# Altium schematic sheet power.SchDoc
size A
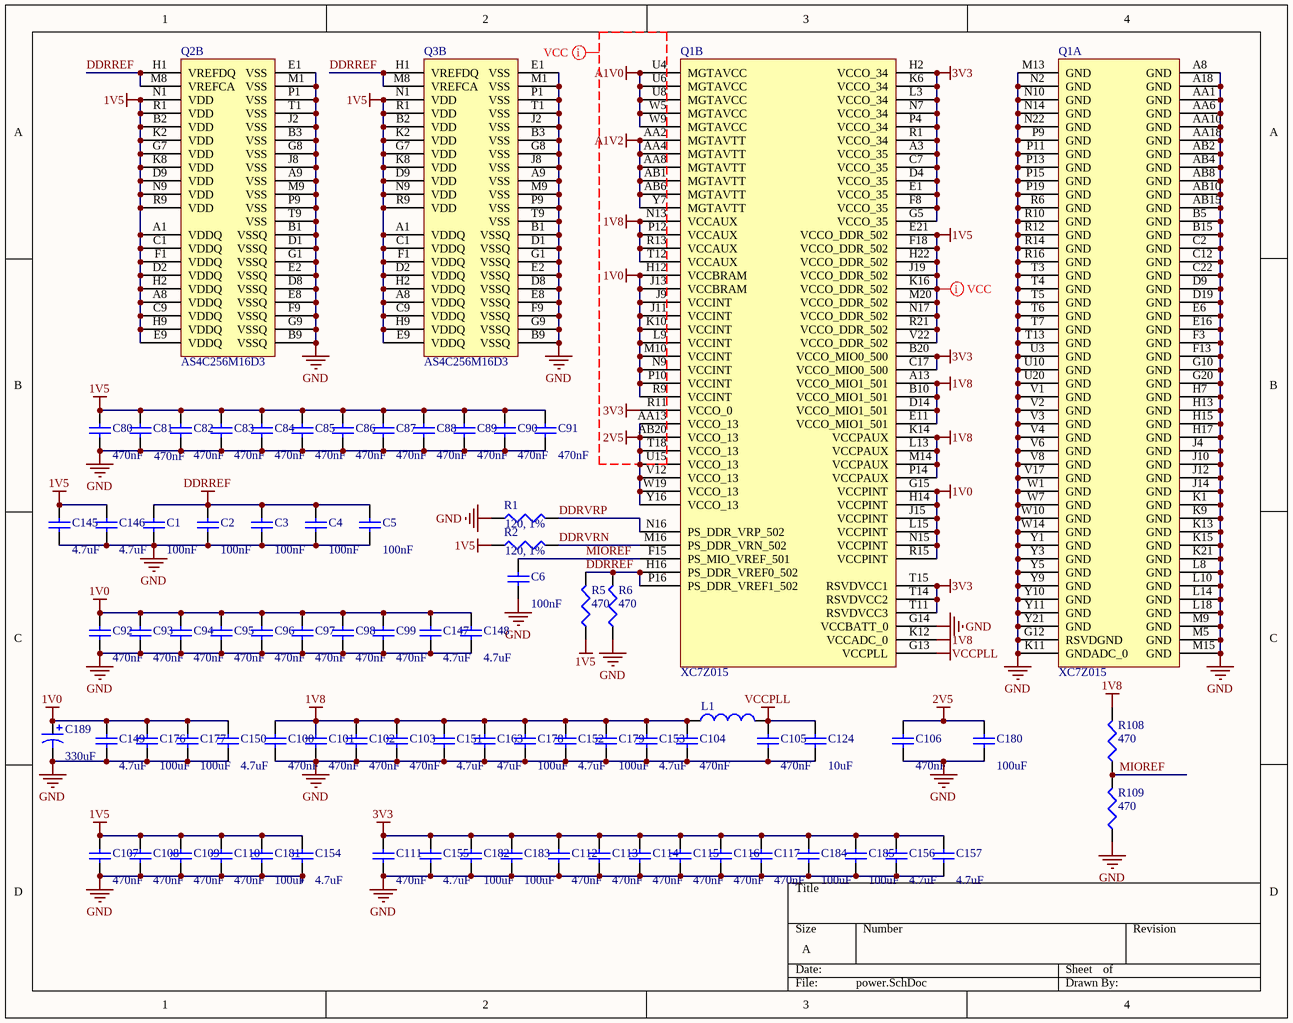
[diagram p0: power.SchDoc]

## Parts
C1  value 100nF  [CAPC1005X06L]  (hidden comment: Cap)
C2  value 100nF  [CAPC1005X06L]  (hidden comment: Cap)
C3  value 100nF  [CAPC1005X06L]  (hidden comment: Cap)
C4  value 100nF  [CAPC1005X06L]  (hidden comment: Cap)
C5  value 100nF  [CAPC1005X06L]  (hidden comment: Cap)
C6  value 100nF  [CAPC1005X06L]  (hidden comment: Cap)
C80  value 470nF  [CAPC1005X06L]  (hidden comment: JMK105BJ474KV-F)
C81  value 470nF  [CAPC1005X06L]  (hidden comment: JMK105BJ474KV-F)
C82  value 470nF  [CAPC1005X06L]  (hidden comment: JMK105BJ474KV-F)
C83  value 470nF  [CAPC1005X06L]  (hidden comment: JMK105BJ474KV-F)
C84  value 470nF  [CAPC1005X06L]  (hidden comment: JMK105BJ474KV-F)
C85  value 470nF  [CAPC1005X06L]  (hidden comment: JMK105BJ474KV-F)
C86  value 470nF  [CAPC1005X06L]  (hidden comment: JMK105BJ474KV-F)
C87  value 470nF  [CAPC1005X06L]  (hidden comment: JMK105BJ474KV-F)
C88  value 470nF  [CAPC1005X06L]  (hidden comment: JMK105BJ474KV-F)
C89  value 470nF  [CAPC1005X06L]  (hidden comment: JMK105BJ474KV-F)
C90  value 470nF  [CAPC1005X06L]  (hidden comment: JMK105BJ474KV-F)
C91  value 470nF  [CAPC1005X06L]  (hidden comment: JMK105BJ474KV-F)
C92  value 470nF  [CAPC1005X06L]  (hidden comment: JMK105BJ474KV-F)
C93  value 470nF  [CAPC1005X06L]  (hidden comment: JMK105BJ474KV-F)
C94  value 470nF  [CAPC1005X06L]  (hidden comment: JMK105BJ474KV-F)
C95  value 470nF  [CAPC1005X06L]  (hidden comment: JMK105BJ474KV-F)
C96  value 470nF  [CAPC1005X06L]  (hidden comment: JMK105BJ474KV-F)
C97  value 470nF  [CAPC1005X06L]  (hidden comment: JMK105BJ474KV-F)
C98  value 470nF  [CAPC1005X06L]  (hidden comment: JMK105BJ474KV-F)
C99  value 470nF  [CAPC1005X06L]  (hidden comment: JMK105BJ474KV-F)
C100  value 470nF  [CAPC1005X06L]  (hidden comment: JMK105BJ474KV-F)
C101  value 470nF  [CAPC1005X06L]  (hidden comment: JMK105BJ474KV-F)
C102  value 470nF  [CAPC1005X06L]  (hidden comment: JMK105BJ474KV-F)
C103  value 470nF  [CAPC1005X06L]  (hidden comment: JMK105BJ474KV-F)
C104  value 470nF  [CAPC1005X06L]  (hidden comment: JMK105BJ474KV-F)
C105  value 470nF  [CAPC1005X06L]  (hidden comment: JMK105BJ474KV-F)
C106  value 470nF  [CAPC1005X06L]  (hidden comment: JMK105BJ474KV-F)
C107  value 470nF  [CAPC1005X06L]  (hidden comment: JMK105BJ474KV-F)
C108  value 470nF  [CAPC1005X06L]  (hidden comment: JMK105BJ474KV-F)
C109  value 470nF  [CAPC1005X06L]  (hidden comment: JMK105BJ474KV-F)
C110  value 470nF  [CAPC1005X06L]  (hidden comment: JMK105BJ474KV-F)
C111  value 470nF  [CAPC1005X06L]  (hidden comment: JMK105BJ474KV-F)
C112  value 470nF  [CAPC1005X06L]  (hidden comment: JMK105BJ474KV-F)
C113  value 470nF  [CAPC1005X06L]  (hidden comment: JMK105BJ474KV-F)
C114  value 470nF  [CAPC1005X06L]  (hidden comment: JMK105BJ474KV-F)
C115  value 470nF  [CAPC1005X06L]  (hidden comment: JMK105BJ474KV-F)
C116  value 470nF  [CAPC1005X06L]  (hidden comment: JMK105BJ474KV-F)
C117  value 470nF  [CAPC1005X06L]  (hidden comment: JMK105BJ474KV-F)
C124  value 10uF  [CAPC1608X90N]  (hidden comment: GRM188R60G106ME47)
C145  value 4.7uF  [CAPC1608X90N]  (hidden comment: GRM188R60J475ME19D)
C146  value 4.7uF  [CAPC1608X90N]  (hidden comment: GRM188R60J475ME19D)
C147  value 4.7uF  [CAPC1608X90N]  (hidden comment: GRM188R60J475ME19D)
C148  value 4.7uF  [CAPC1608X90N]  (hidden comment: GRM188R60J475ME19D)
C149  value 4.7uF  [CAPC1608X90N]  (hidden comment: GRM188R60J475ME19D)
C150  value 4.7uF  [CAPC1608X90N]  (hidden comment: GRM188R60J475ME19D)
C151  value 4.7uF  [CAPC1608X90N]  (hidden comment: GRM188R60J475ME19D)
C152  value 4.7uF  [CAPC1608X90N]  (hidden comment: GRM188R60J475ME19D)
C153  value 4.7uF  [CAPC1608X90N]  (hidden comment: GRM188R60J475ME19D)
C154  value 4.7uF  [CAPC1608X90N]  (hidden comment: GRM188R60J475ME19D)
C155  value 4.7uF  [CAPC1608X90N]  (hidden comment: GRM188R60J475ME19D)
C156  value 4.7uF  [CAPC1608X90N]  (hidden comment: GRM188R60J475ME19D)
C157  value 4.7uF  [CAPC1608X90N]  (hidden comment: GRM188R60J475ME19D)
C163  value 47uF  [CAPC3225X220N]  (hidden comment: GRM31CR60J476ME19L)
C176  value 100uF  [CAPC3225X220N]  (hidden comment: GRM31CR60J107ME39L)
C177  value 100uF  [CAPC3225X220N]  (hidden comment: GRM31CR60J107ME39L)
C178  value 100uF  [CAPC3225X220N]  (hidden comment: GRM31CR60J107ME39L)
C179  value 100uF  [CAPC3225X220N]  (hidden comment: GRM31CR60J107ME39L)
C180  value 100uF  [CAPC3225X220N]  (hidden comment: GRM31CR60J107ME39L)
C181  value 100uF  [CAPC3225X220N]  (hidden comment: GRM31CR60J107ME39L)
C182  value 100uF  [CAPC3225X220N]  (hidden comment: GRM31CR60J107ME39L)
C183  value 100uF  [CAPC3225X220N]  (hidden comment: GRM31CR60J107ME39L)
C184  value 100uF  [CAPC3225X220N]  (hidden comment: GRM31CR60J107ME39L)
C185  value 100uF  [CAPC3225X220N]  (hidden comment: GRM31CR60J107ME39L)
C189  value 330uF  [CAP-D/7343-31]  (hidden comment: T520D337M006ATE018)
L1  BLM18SG121TN1  [CAPC1608X90N]  (value not drawn)
Q1  XC7Z015  [BGA484x22]  (parts A,B of 9)
Q2  AS4C256M16D3  [DDR3]  (part B of 2)
Q3  AS4C256M16D3  [DDR3]  (part B of 2)
R1  value 120, 1%  [CAPC1005X06L]  (hidden comment: RC1005F121CS)
R2  value 120, 1%  [CAPC1005X06L]  (hidden comment: RC1005F121CS)
R5  value 470  [J1-0603]  (hidden comment: RC1608F471CS)
R6  value 470  [J1-0603]  (hidden comment: RC1608F471CS)
R108  value 470  [CAPC1005X06L]  (hidden comment: RC1005F471CS)
R109  value 470  [CAPC1005X06L]  (hidden comment: RC1005F471CS)

## Nets
1V0: C92.2 C93.2 C94.2 C95.2 C96.2 C97.2 C98.2 C99.2 C147.2 C148.2 C149.2 C150.2 C176.2 C177.2 C189.1 Q1.G15(VCCPINT) Q1.H12(VCCBRAM) Q1.H14(VCCPINT) Q1.J9(VCCINT) Q1.J11(VCCINT) Q1.J13(VCCBRAM) Q1.J15(VCCPINT) Q1.K10(VCCINT) Q1.L9(VCCINT) Q1.L15(VCCPINT) Q1.M10(VCCINT) Q1.N9(VCCINT) Q1.N15(VCCPINT) Q1.P10(VCCINT) Q1.R9(VCCINT) Q1.R15(VCCPINT)
1V5: C80.2 C81.2 C82.2 C83.2 C84.2 C85.2 C86.2 C87.2 C88.2 C89.2 C90.2 C91.2 C107.2 C108.2 C109.2 C110.2 C145.2 C146.2 C154.2 C181.2 Q1.E21(VCCO_DDR_502) Q1.F18(VCCO_DDR_502) Q1.H22(VCCO_DDR_502) Q1.J19(VCCO_DDR_502) Q1.K16(VCCO_DDR_502) Q1.M20(VCCO_DDR_502) Q1.N17(VCCO_DDR_502) Q1.R21(VCCO_DDR_502) Q1.V22(VCCO_DDR_502) Q2.A1(VDDQ) Q2.A8(VDDQ) Q2.B2(VDD) Q2.C1(VDDQ) Q2.C9(VDDQ) Q2.D2(VDDQ) Q2.D9(VDD) Q2.E9(VDDQ) Q2.F1(VDDQ) Q2.G7(VDD) Q2.H2(VDDQ) Q2.H9(VDDQ) Q2.K2(VDD) Q2.K8(VDD) Q2.N1(VDD) Q2.N9(VDD) Q2.R1(VDD) Q2.R9(VDD) Q3.A1(VDDQ) Q3.A8(VDDQ) Q3.B2(VDD) Q3.C1(VDDQ) Q3.C9(VDDQ) Q3.D2(VDDQ) Q3.D9(VDD) Q3.E9(VDDQ) Q3.F1(VDDQ) Q3.G7(VDD) Q3.H2(VDDQ) Q3.H9(VDDQ) Q3.K2(VDD) Q3.K8(VDD) Q3.N1(VDD) Q3.N9(VDD) Q3.R1(VDD) Q3.R9(VDD) R2.1 R5.1
1V8: C100.2 C101.2 C102.2 C103.2 C104.2 C151.2 C152.2 C153.2 C163.2 C178.2 C179.2 L1.1 Q1.A13(VCCO_MIO1_501) Q1.B10(VCCO_MIO1_501) Q1.D14(VCCO_MIO1_501) Q1.E11(VCCO_MIO1_501) Q1.K12(VCCADC_0) Q1.K14(VCCPAUX) Q1.L13(VCCPAUX) Q1.M14(VCCPAUX) Q1.N13(VCCAUX) Q1.P12(VCCAUX) Q1.P14(VCCPAUX) Q1.R13(VCCAUX) Q1.T12(VCCAUX) R108.2
2V5: C106.2 C180.2 Q1.AA13(VCCO_13) Q1.AB20(VCCO_13) Q1.T18(VCCO_13) Q1.U15(VCCO_13) Q1.V12(VCCO_13) Q1.W19(VCCO_13) Q1.Y16(VCCO_13)
3V3: C111.2 C112.2 C113.2 C114.2 C115.2 C116.2 C117.2 C155.2 C156.2 C157.2 C182.2 C183.2 C184.2 C185.2 Q1.A3(VCCO_35) Q1.B20(VCCO_MIO0_500) Q1.C7(VCCO_35) Q1.C17(VCCO_MIO0_500) Q1.D4(VCCO_35) Q1.E1(VCCO_35) Q1.F8(VCCO_35) Q1.G5(VCCO_35) Q1.H2(VCCO_34) Q1.K6(VCCO_34) Q1.L3(VCCO_34) Q1.N7(VCCO_34) Q1.P4(VCCO_34) Q1.R1(VCCO_34) Q1.R11(VCCO_0) Q1.T11(RSVDVCC3) Q1.T14(RSVDVCC2) Q1.T15(RSVDVCC1)
A1V0: Q1.U4(MGTAVCC) Q1.U6(MGTAVCC) Q1.U8(MGTAVCC) Q1.W5(MGTAVCC) Q1.W9(MGTAVCC)
A1V2: Q1.AA2(MGTAVTT) Q1.AA4(MGTAVTT) Q1.AA8(MGTAVTT) Q1.AB1(MGTAVTT) Q1.AB6(MGTAVTT) Q1.Y7(MGTAVTT)
DDRREF: C1.2 C2.2 C3.2 C4.2 C5.2 Q1.H16(PS_DDR_VREF0_502) Q1.P16(PS_DDR_VREF1_502) Q2.H1(VREFDQ) Q2.M8(VREFCA) Q3.H1(VREFDQ) Q3.M8(VREFCA) R5.2 R6.2
GND: C1.1 C2.1 C3.1 C4.1 C5.1 C6.1 C80.1 C81.1 C82.1 C83.1 C84.1 C85.1 C86.1 C87.1 C88.1 C89.1 C90.1 C91.1 C92.1 C93.1 C94.1 C95.1 C96.1 C97.1 C98.1 C99.1 C100.1 C101.1 C102.1 C103.1 C104.1 C105.1 C106.1 C107.1 C108.1 C109.1 C110.1 C111.1 C112.1 C113.1 C114.1 C115.1 C116.1 C117.1 C124.1 C145.1 C146.1 C147.1 C148.1 C149.1 C150.1 C151.1 C152.1 C153.1 C154.1 C155.1 C156.1 C157.1 C163.1 C176.1 C177.1 C178.1 C179.1 C180.1 C181.1 C182.1 C183.1 C184.1 C185.1 C189.2 Q1.A8(GND) Q1.A18(GND) Q1.AA1(GND) Q1.AA6(GND) Q1.AA10(GND) Q1.AA18(GND) Q1.AB2(GND) Q1.AB4(GND) Q1.AB8(GND) Q1.AB10(GND) Q1.AB15(GND) Q1.B5(GND) Q1.B15(GND) Q1.C2(GND) Q1.C12(GND) Q1.C22(GND) Q1.D9(GND) Q1.D19(GND) Q1.E6(GND) Q1.E16(GND) Q1.F3(GND) Q1.F13(GND) Q1.G10(GND) Q1.G12(RSVDGND) Q1.G14(VCCBATT_0) Q1.G20(GND) Q1.H7(GND) Q1.H13(GND) Q1.H15(GND) Q1.H17(GND) Q1.J4(GND) Q1.J10(GND) Q1.J12(GND) Q1.J14(GND) Q1.K1(GND) Q1.K9(GND) Q1.K11(GNDADC_0) Q1.K13(GND) Q1.K15(GND) Q1.K21(GND) Q1.L8(GND) Q1.L10(GND) Q1.L14(GND) Q1.L18(GND) Q1.M5(GND) Q1.M9(GND) Q1.M13(GND) Q1.M15(GND) Q1.N2(GND) Q1.N10(GND) Q1.N14(GND) Q1.N22(GND) Q1.P9(GND) Q1.P11(GND) Q1.P13(GND) Q1.P15(GND) Q1.P19(GND) Q1.R6(GND) Q1.R10(GND) Q1.R12(GND) Q1.R14(GND) Q1.R16(GND) Q1.T3(GND) Q1.T4(GND) Q1.T5(GND) Q1.T6(GND) Q1.T7(GND) Q1.T13(GND) Q1.U3(GND) Q1.U10(GND) Q1.U20(GND) Q1.V1(GND) Q1.V2(GND) Q1.V3(GND) Q1.V4(GND) Q1.V6(GND) Q1.V8(GND) Q1.V17(GND) Q1.W1(GND) Q1.W7(GND) Q1.W10(GND) Q1.W14(GND) Q1.Y1(GND) Q1.Y3(GND) Q1.Y5(GND) Q1.Y9(GND) Q1.Y10(GND) Q1.Y11(GND) Q1.Y21(GND) Q2.A9(VSS) Q2.B1(VSSQ) Q2.B3(VSS) Q2.B9(VSSQ) Q2.D1(VSSQ) Q2.D8(VSSQ) Q2.E1(VSS) Q2.E2(VSSQ) Q2.E8(VSSQ) Q2.F9(VSSQ) Q2.G1(VSSQ) Q2.G8(VSS) Q2.G9(VSSQ) Q2.J2(VSS) Q2.J8(VSS) Q2.M1(VSS) Q2.M9(VSS) Q2.P1(VSS) Q2.P9(VSS) Q2.T1(VSS) Q2.T9(VSS) Q3.A9(VSS) Q3.B1(VSSQ) Q3.B3(VSS) Q3.B9(VSSQ) Q3.D1(VSSQ) Q3.D8(VSSQ) Q3.E1(VSS) Q3.E2(VSSQ) Q3.E8(VSSQ) Q3.F9(VSSQ) Q3.G1(VSSQ) Q3.G8(VSS) Q3.G9(VSSQ) Q3.J2(VSS) Q3.J8(VSS) Q3.M1(VSS) Q3.M9(VSS) Q3.P1(VSS) Q3.P9(VSS) Q3.T1(VSS) Q3.T9(VSS) R1.1 R6.1 R109.1
VCCPLL: C105.2 C124.2 L1.2 Q1.G13(VCCPLL)
DDRVRN: Q1.M16(PS_DDR_VRN_502) R2.2
DDRVRP: Q1.N16(PS_DDR_VRP_502) R1.2
MIOREF: C6.2 Q1.F15(PS_MIO_VREF_501) R108.1 R109.2

## Layout directives
net class VCC: 1V0, 1V5, 1V8, 2V5, 3V3, A1V0, A1V2

## Library data of the parts
C1-C6 C80-C117 C124 C145-C157 C163 C176-C185 = Cap: Capacitor; Published: 8-Jun-2000; LatestRevisionDate: 17-Jul-2002; LatestRevisionNote: Re-released for DXP Platform.; PackageReference: RAD-0.3; Publisher: Altium Limited; PackageDescription: Radial Cap, Thru-Hole; 2 Leads; 0.3 in Pin Spacing; Supplier 1: Digi-Key
  C1-C6: Supplier Part Number 1: 1276-1443-1-ND
  C80-C117: Supplier Part Number 1: 587-1230-1-ND
  C124: Supplier Part Number 1: 490-3298-1-ND
  C145-C157: Supplier Part Number 1: 490-5421-1-ND
  C163: Supplier Part Number 1: 490-3907-1-ND
  C176-C185: Supplier Part Number 1: 490-4539-1-ND
C189 = Cap Pol1: Polarized Capacitor (Radial); Published: 8-Jun-2000; LatestRevisionDate: 17-Jul-2002; LatestRevisionNote: Re-released for DXP Platform.; PackageReference: RB7.6-15; Publisher: Altium Limited; PackageDescription: Polarized Capacitor (Radial); 2 Leads; Supplier 1: Digi-Key; Supplier Part Number 1: 399-5149-1-ND
L1 = Inductor: Code_IEC: 1005; Value: 10mH; Published: 8-Jun-2000; LatestRevisionDate: 29-May-2009; LatestRevisionNote: IPC-7351 Footprint Added.; PackageReference: 0402-A; Publisher: Altium Limited; PackageDescription: Chip Inductor; Code_JEITA: 0402; Supplier 1: Digi-Key; Supplier Part Number 1: 490-3996-1-ND
R1 R2 R5 R6 R108 R109 = Res3: Resistor; Published: 8-Jun-2000; LatestRevisionDate: 29-May-2009; LatestRevisionNote: IPC-7351 Footprint Added.; PackageReference: J1-0603; Publisher: Altium Limited; PackageDescription: Chip Resistor; Supplier 1: Digi-Key
  R1 R2: Supplier Part Number 1: 1276-3947-1-ND
  R5 R6: Supplier Part Number 1: 1276-4619-1-ND
  R108 R109: Supplier Part Number 1: 1276-3989-1-ND
Q1 = XC7Z015: Supplier 1: Digi-Key; Supplier Part Number 1: 122-1905-ND
Q2 Q3 = AS4C256M16D3: Supplier 1: Digi-Key; Supplier Part Number 1: 1450-1095-ND